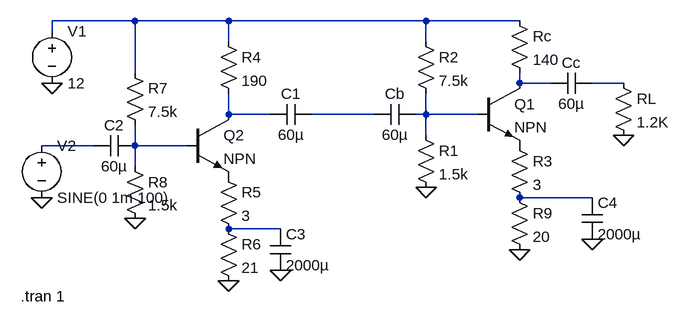
[diagram p0: schematic 2 stage CE amplifier.asc]
2 stage CE amplifier.asc, the LTspice schematic file:
Version 4
SHEET 1 880 680
WIRE -368 32 -496 32
WIRE -224 32 -368 32
WIRE 80 32 -224 32
WIRE 224 32 80 32
WIRE -496 48 -496 32
WIRE -224 64 -224 32
WIRE 80 64 80 32
WIRE -368 112 -368 32
WIRE 224 128 224 112
WIRE 272 128 224 128
WIRE 384 128 336 128
WIRE -224 176 -224 144
WIRE -160 176 -224 176
WIRE 0 176 -96 176
WIRE 80 176 80 144
WIRE 80 176 64 176
WIRE 160 176 80 176
WIRE 80 208 80 176
WIRE -432 224 -512 224
WIRE -368 224 -368 192
WIRE -288 224 -368 224
WIRE -368 256 -368 224
WIRE 336 304 224 304
WIRE -144 352 -224 352
FLAG 384 208 0
FLAG 80 288 0
FLAG -368 336 0
FLAG -496 128 0
FLAG -512 304 0
FLAG 224 384 0
FLAG 336 368 0
FLAG -144 416 0
FLAG -224 432 0
SYMBOL npn 160 128 R0
SYMATTR InstName Q1
SYMBOL res 368 112 R0
SYMATTR InstName RL
SYMATTR Value 1.2K
SYMBOL res 208 16 R0
SYMATTR InstName Rc
SYMATTR Value 140
SYMBOL res 64 48 R0
SYMATTR InstName R2
SYMATTR Value 7.5k
SYMBOL res 64 192 R0
SYMATTR InstName R1
SYMATTR Value 1.5k
SYMBOL cap 336 112 R90
WINDOW 0 0 32 VBottom 2
WINDOW 3 32 32 VTop 2
SYMATTR InstName Cc
SYMATTR Value 60µ
SYMBOL cap 64 160 R90
WINDOW 0 0 32 VBottom 2
WINDOW 3 32 32 VTop 2
SYMATTR InstName Cb
SYMATTR Value 60µ
SYMBOL npn -288 176 R0
SYMATTR InstName Q2
SYMBOL cap -96 160 R90
WINDOW 0 0 32 VBottom 2
WINDOW 3 32 32 VTop 2
SYMATTR InstName C1
SYMATTR Value 60µ
SYMBOL res -240 48 R0
SYMATTR InstName R4
SYMATTR Value 190
SYMBOL res -384 96 R0
SYMATTR InstName R7
SYMATTR Value 7.5k
SYMBOL res -384 240 R0
SYMATTR InstName R8
SYMATTR Value 1.5k
SYMBOL cap -368 208 R90
WINDOW 0 0 32 VBottom 2
WINDOW 3 32 32 VTop 2
SYMATTR InstName C2
SYMATTR Value 60µ
SYMBOL voltage -496 32 R0
WINDOW 123 0 0 Left 0
WINDOW 39 0 0 Left 0
SYMATTR InstName V1
SYMATTR Value 12
SYMBOL voltage -512 208 R0
WINDOW 123 0 0 Left 0
WINDOW 39 0 0 Left 0
SYMATTR InstName V2
SYMATTR Value SINE(0 1m 100)
SYMBOL res 208 208 R0
SYMATTR InstName R3
SYMATTR Value 3
SYMBOL res 208 288 R0
SYMATTR InstName R9
SYMATTR Value 20
SYMBOL cap 320 304 R0
SYMATTR InstName C4
SYMATTR Value 2000µ
SYMBOL res -240 256 R0
SYMATTR InstName R5
SYMATTR Value 3
SYMBOL res -240 336 R0
SYMATTR InstName R6
SYMATTR Value 21
SYMBOL cap -160 352 R0
SYMATTR InstName C3
SYMATTR Value 2000µ
TEXT -544 456 Left 2 !.tran 1

The netlist it stands for:
* 2 stage CE amplifier.asc
Q1 N002 N006 P001 0 NPN
RL N003 0 1.2K
Rc N001 N002 140
R2 N001 N006 7.5k
R1 N006 0 1.5k
Cc N003 N002 60µ
Cb N006 N005 60µ
Q2 N004 N008 P002 0 NPN
C1 N005 N004 60µ
R4 N001 N004 190
R7 N001 N008 7.5k
R8 N008 0 1.5k
C2 N008 N007 60µ
V1 N001 0 12
V2 N007 0 SINE(0 1m 100)
R3 P001 N009 3
R9 N009 0 20
C4 N009 0 2000µ
R5 P002 N010 3
R6 N010 0 21
C3 N010 0 2000µ
.model NPN NPN
.model PNP PNP
.lib standard.bjt
.tran 1
.backanno
.end